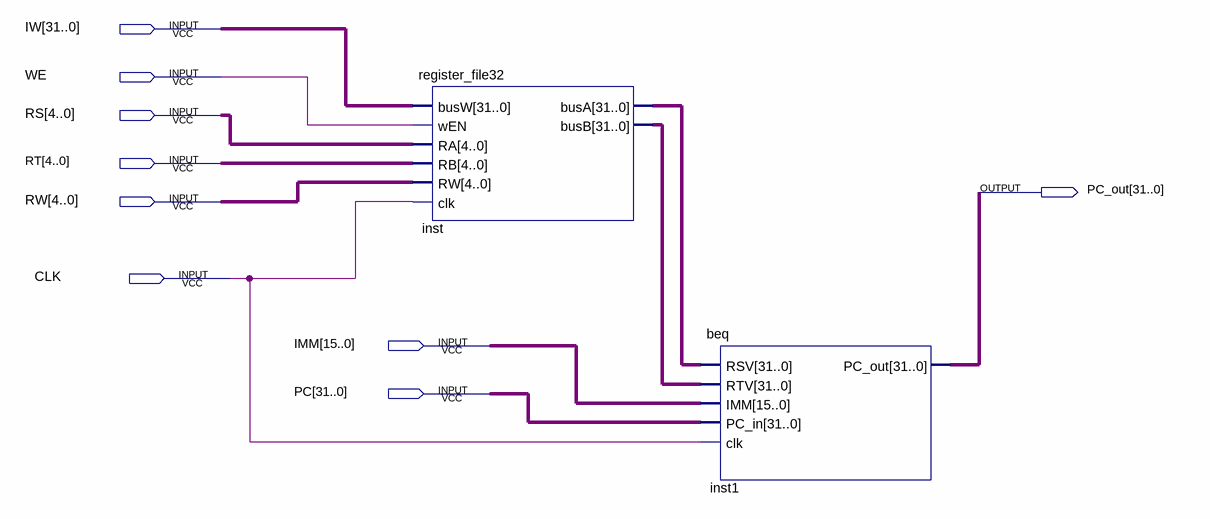
[diagram p0: schematic sheet]
// Quartus schematic datapath.bdf as structural Verilog: 2 symbols, 9 pins
module datapath (
  input  [31:0] IW,
  input  WE,
  input  [4:0] RS,
  input  [4:0] RT,
  input  [4:0] RW,
  input  CLK,
  input  [15:0] IMM,
  input  [31:0] PC,
  output [31:0] PC_out
);

  wire [31:0] inst_busa, inst_busb;

  register_file32 inst (.busW(IW), .wEN(WE), .RA(RS), .RB(RT), .RW(RW), .clk(CLK), .busA(inst_busa), .busB(inst_busb));
  beq inst1 (.RSV(inst_busa), .RTV(inst_busb), .IMM(IMM), .PC_in(PC), .clk(CLK), .PC_out(PC_out));
endmodule
